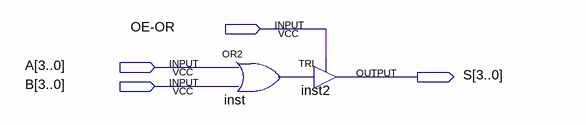
[diagram p0: schematic sheet]
// Quartus schematic OR_4.bdf as structural Verilog: 2 symbols, 4 pins
module OR_4 (
  input  \OE-OR ,
  input  [3:0] A,
  input  [3:0] B,
  output [3:0] S
);

  wire inst_out;

  assign inst_out = A | B;  // OR2 inst, 4 bits wide
  TRI inst2[3:0] (.IN(inst_out), .OE(\OE-OR ), .OUT(S));
endmodule
